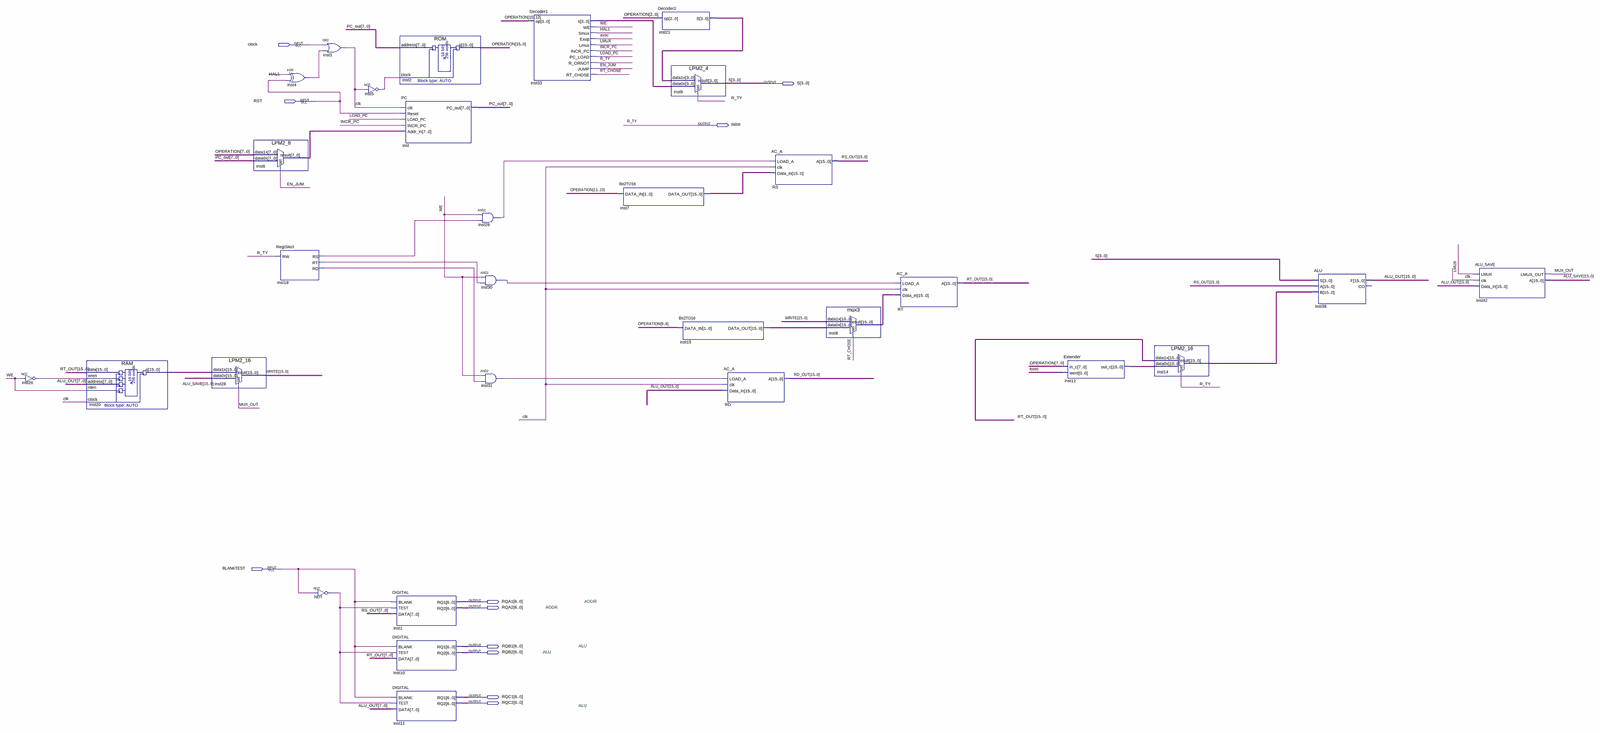
[diagram p0: schematic sheet, whole]
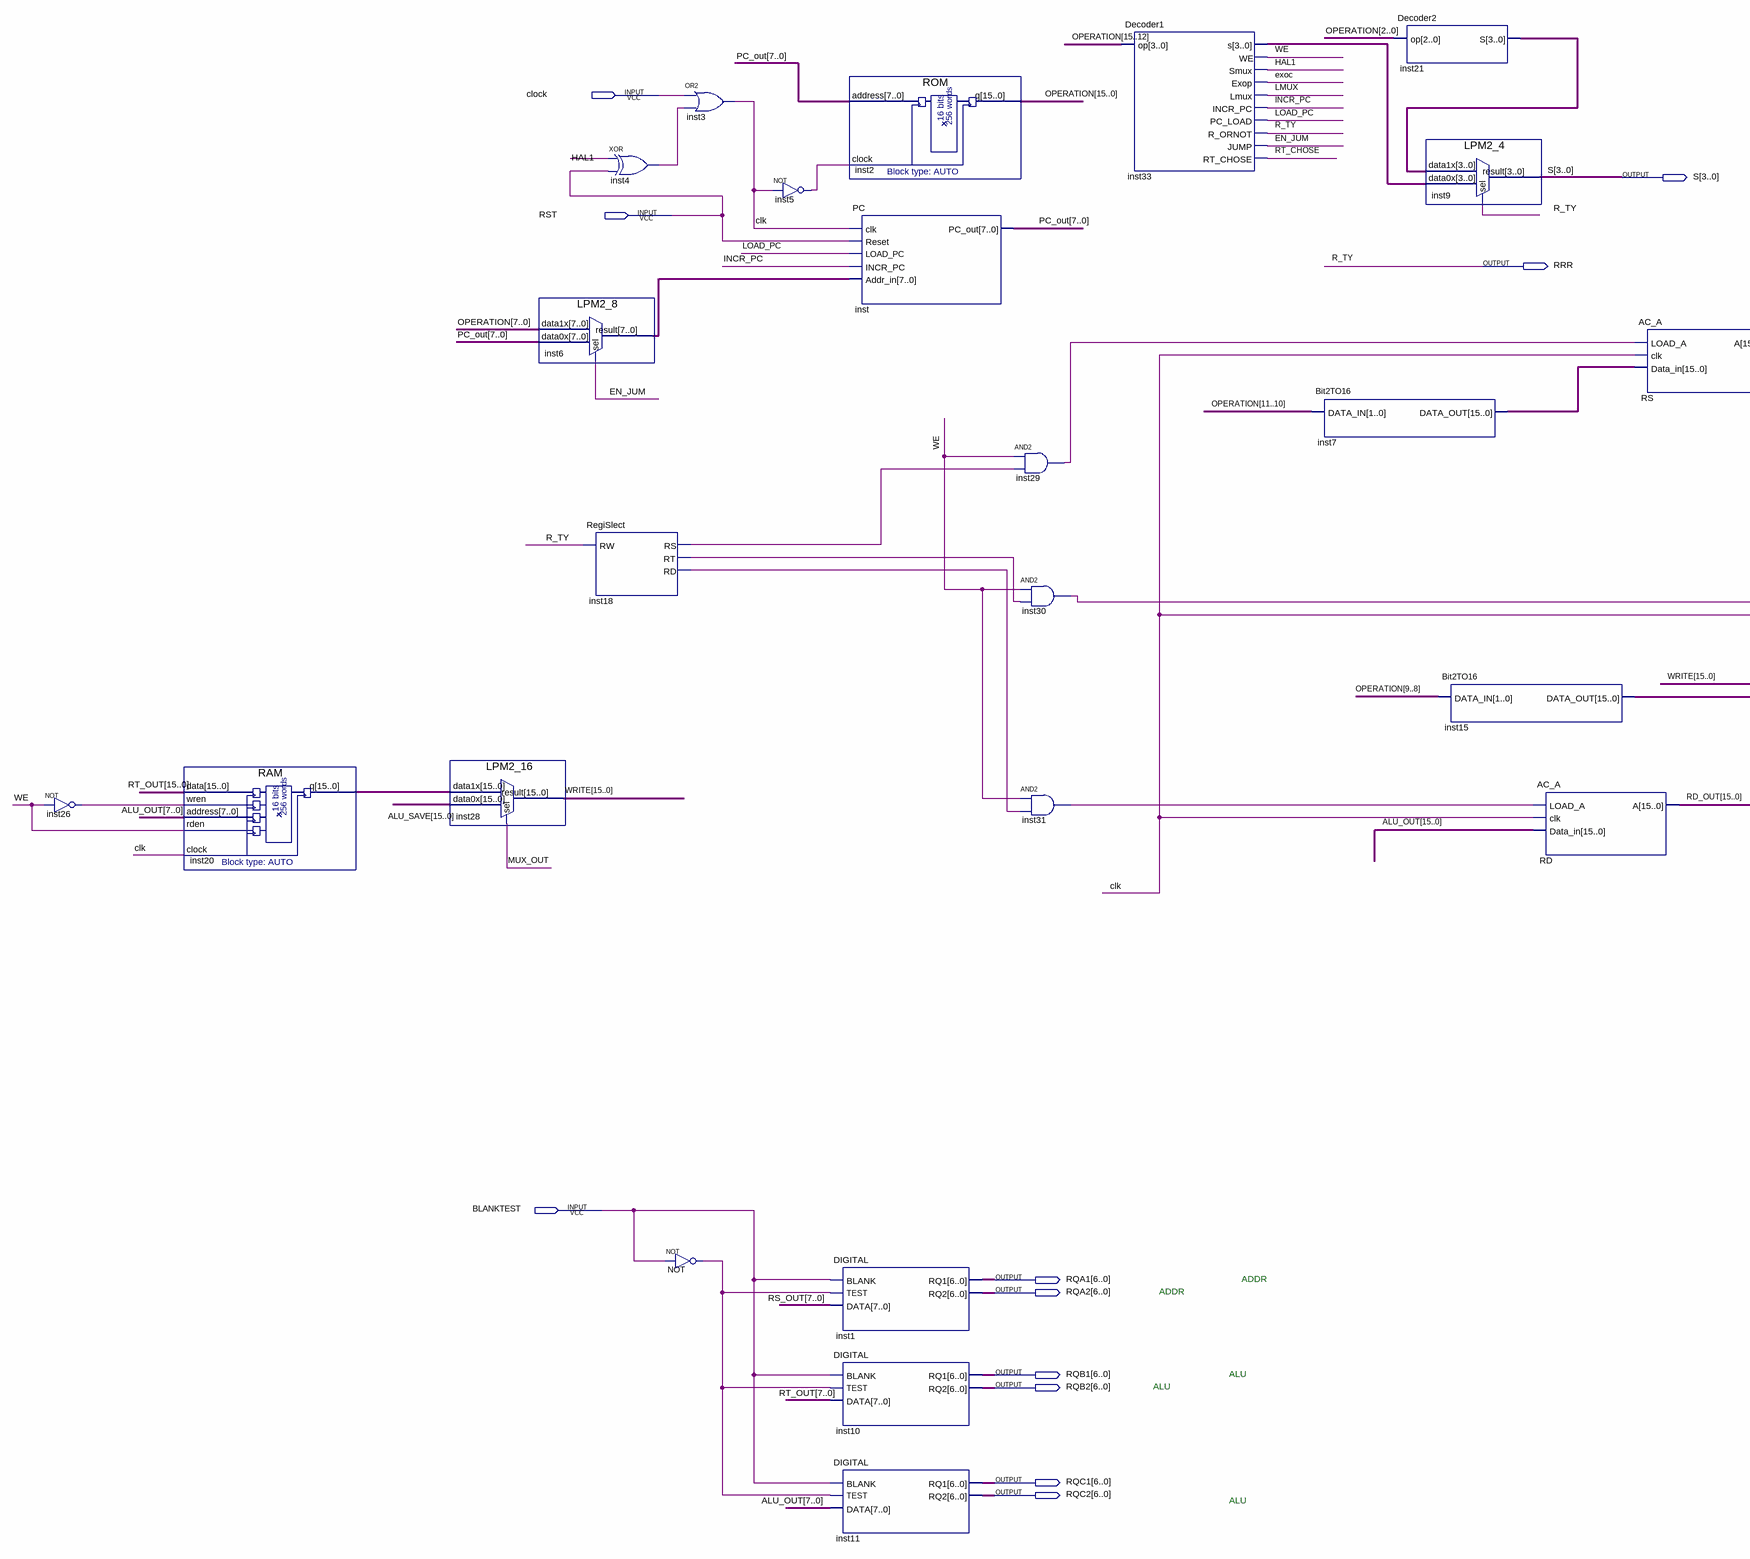
[diagram p1: schematic sheet, left part]
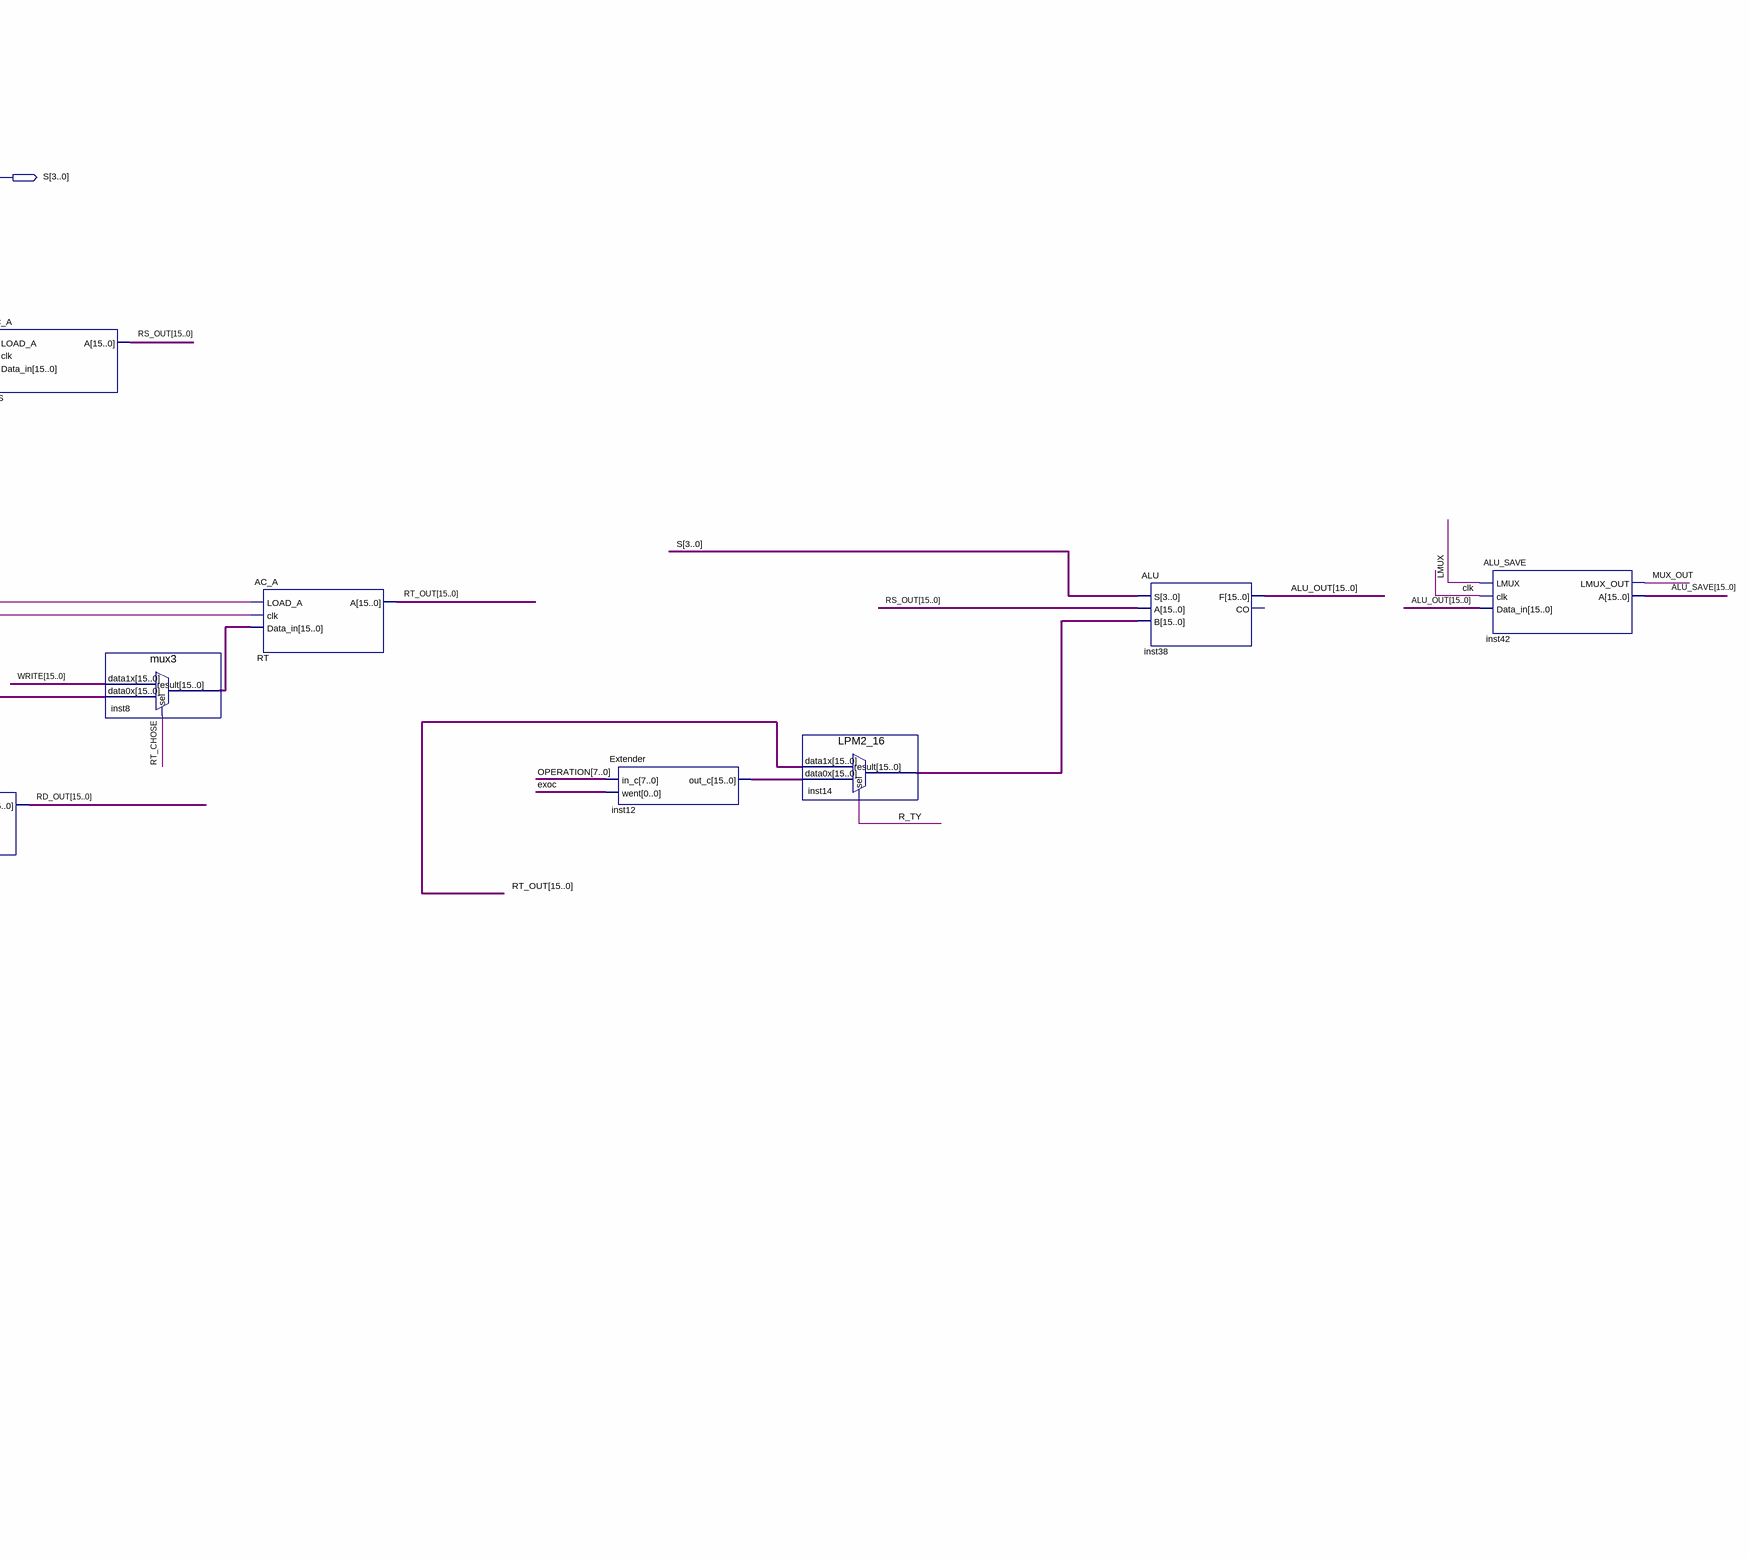
[diagram p2: schematic sheet, right part]
// Quartus schematic CPU.bdf as structural Verilog: 30 symbols, 11 pins
module CPU (
  input  clock,
  input  RST,
  input  BLANKTEST,
  output [3:0] S,
  output RRR,
  output [6:0] RQA1,
  output [6:0] RQA2,
  output [6:0] RQB1,
  output [6:0] RQB2,
  output [6:0] RQC1,
  output [6:0] RQC2
);

  wire clk, EN_JUM, exoc, HAL1, INCR_PC, inst4_out, inst5_out, inst18_rd, inst18_rs, inst18_rt, inst26_out,
       inst29_out, inst30_out, inst31_out, LMUX, LOAD_PC, MUX_OUT, NOT_out, RT_CHOSE, WE;
  wire [3:0] inst21_s, inst33_s;
  wire [7:0] inst6_result, PC_out;
  wire [15:0] ALU_OUT, ALU_SAVE, inst7_data_out, inst8_result, inst12_out_c, inst14_result, inst15_data_out,
       inst20_q, OPERATION, RD_OUT, RS_OUT, RT_OUT, WRITE;

  not inst26 (inst26_out, WE);
  RAM inst20 (.data(RT_OUT), .wren(inst26_out), .address(ALU_OUT[7:0]), .rden(WE), .clock(clk), .q(inst20_q));
  LPM2_16 inst28 (.data1x(inst20_q), .data0x(ALU_SAVE), .sel(MUX_OUT), .result(WRITE));
  LPM2_8 inst6 (.data1x(OPERATION[7:0]), .data0x(PC_out), .sel(EN_JUM), .result(inst6_result));
  RegiSlect inst18 (.RW(RRR), .RS(inst18_rs), .RT(inst18_rt), .RD(inst18_rd));
  xor inst4 (inst4_out, HAL1, RST);
  or inst3 (clk, clock, inst4_out);
  not NOT (NOT_out, BLANKTEST);
  not inst5 (inst5_out, clk);
  ROM inst2 (.address(PC_out), .clock(inst5_out), .q(OPERATION));
  PC inst (.clk(clk), .Reset(RST), .LOAD_PC(LOAD_PC), .INCR_PC(INCR_PC), .Addr_in(inst6_result), .PC_out(PC_out));
  DIGITAL inst1 (.BLANK(BLANKTEST), .TEST(NOT_out), .DATA(RS_OUT[7:0]), .RQ1(RQA1), .RQ2(RQA2));
  DIGITAL inst10 (.BLANK(BLANKTEST), .TEST(NOT_out), .DATA(RT_OUT[7:0]), .RQ1(RQB1), .RQ2(RQB2));
  DIGITAL inst11 (.BLANK(BLANKTEST), .TEST(NOT_out), .DATA(ALU_OUT[7:0]), .RQ1(RQC1), .RQ2(RQC2));
  and inst29 (inst29_out, WE, inst18_rs);
  and inst30 (inst30_out, WE, inst18_rt);
  and inst31 (inst31_out, WE, inst18_rd);
  Decoder1 inst33 (
    .op(OPERATION[15:12]), .s(inst33_s), .WE(WE), .Smux(HAL1), .Exop(exoc), .Lmux(LMUX), .INCR_PC(INCR_PC),
    .PC_LOAD(LOAD_PC), .R_ORNOT(RRR), .JUMP(EN_JUM), .RT_CHOSE(RT_CHOSE));
  Bit2TO16 inst7 (.DATA_IN(OPERATION[11:10]), .DATA_OUT(inst7_data_out));
  Decoder2 inst21 (.op(OPERATION[2:0]), .S(inst21_s));
  LPM2_4 inst9 (.data1x(inst21_s), .data0x(inst33_s), .sel(RRR), .result(S));
  Bit2TO16 inst15 (.DATA_IN(OPERATION[9:8]), .DATA_OUT(inst15_data_out));
  AC_A RD (.LOAD_A(inst31_out), .clk(clk), .Data_in(ALU_OUT), .A(RD_OUT));
  AC_A RS (.LOAD_A(inst29_out), .clk(clk), .Data_in(inst7_data_out), .A(RS_OUT));
  mux3 inst8 (.data1x(WRITE), .data0x(inst15_data_out), .sel(RT_CHOSE), .result(inst8_result));
  AC_A RT (.LOAD_A(inst30_out), .clk(clk), .Data_in(inst8_result), .A(RT_OUT));
  Extender inst12 (.in_c(OPERATION[7:0]), .went(exoc), .out_c(inst12_out_c));
  LPM2_16 inst14 (.data1x(RT_OUT), .data0x(inst12_out_c), .sel(RRR), .result(inst14_result));
  ALU inst38 (.S(S), .A(RS_OUT), .B(inst14_result), .F(ALU_OUT));  // open: CO
  ALU_SAVE inst42 (.LMUX(LMUX), .clk(clk), .Data_in(ALU_OUT), .LMUX_OUT(MUX_OUT), .A(ALU_SAVE));

  // Other names for the same wires on the sheet: R_TY = RRR

  // Notes on the sheet:
  //   ADDR
  //   ADDR
  //   ALU
  //   ALU
  //   ALU
endmodule
